# Altium schematic sheet Sheet1.SchDoc
size A4; SheetNumber: 4; SheetTotal: 4
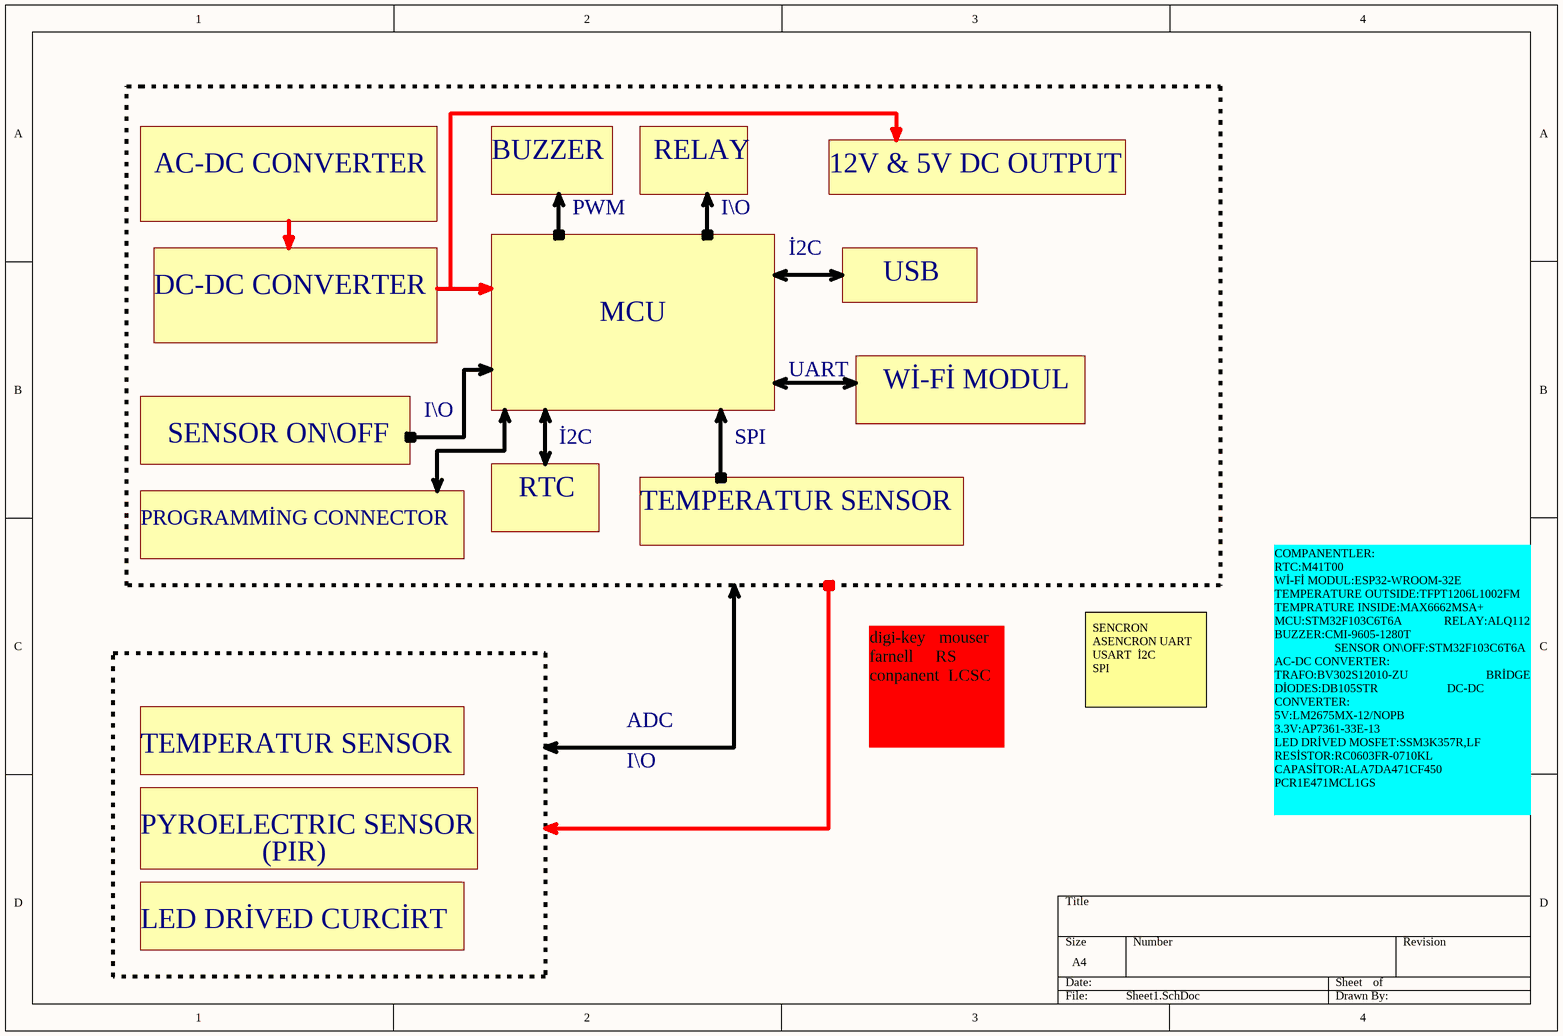
[diagram p0: Sheet1.SchDoc]

## Notes on the sheet
- AC-DC CONVERTER
- BUZZER
- RELAY
- 12V & 5V DC OUTPUT
- PWM
- I\O
- DC-DC CONVERTER
- İ2C
- USB
- MCU
- UART
- SENSOR ON\OFF
- SPI
- Wİ-Fİ MODUL
- RTC
- TEMPERATUR SENSOR
- PROGRAMMİNG CONNECTOR
- SENCRON ASENCRON UART USART  İ2C             SPI
- ADC
- digi-key   mouser    farnell     RS conpanent  LCSC
- PYROELECTRIC SENSOR
- COMPANENTLER:                                                          RTC:M41T00                                                                      Wİ-Fİ MODUL:ESP32-WROOM-32E                                 TEMPERATURE OUTSIDE:TFPT1206L1002FM         TEMPRATURE INSIDE:MAX6662MSA+      MCU:STM32F103C6T6A              RELAY:ALQ112           BUZZER:CMI-9605-1280T
  SENSOR ON\OFF:STM32F103C6T6A          AC-DC CONVERTER:              TRAFO:BV302S12010-ZU                          BRİDGE DİODES:DB105STR                       DC-DC CONVERTER:                         5V:LM2675MX-12/NOPB                                            3.3V:AP7361-33E-13
  LED DRİVED MOSFET:SSM3K357R,LF RESİSTOR:RC0603FR-0710KL
  CAPASİTOR:ALA7DA471CF450       PCR1E471MCL1GS
- (PIR)
- LED DRİVED CURCİRT